# Altium project 解析板V1.0.PrjPcb
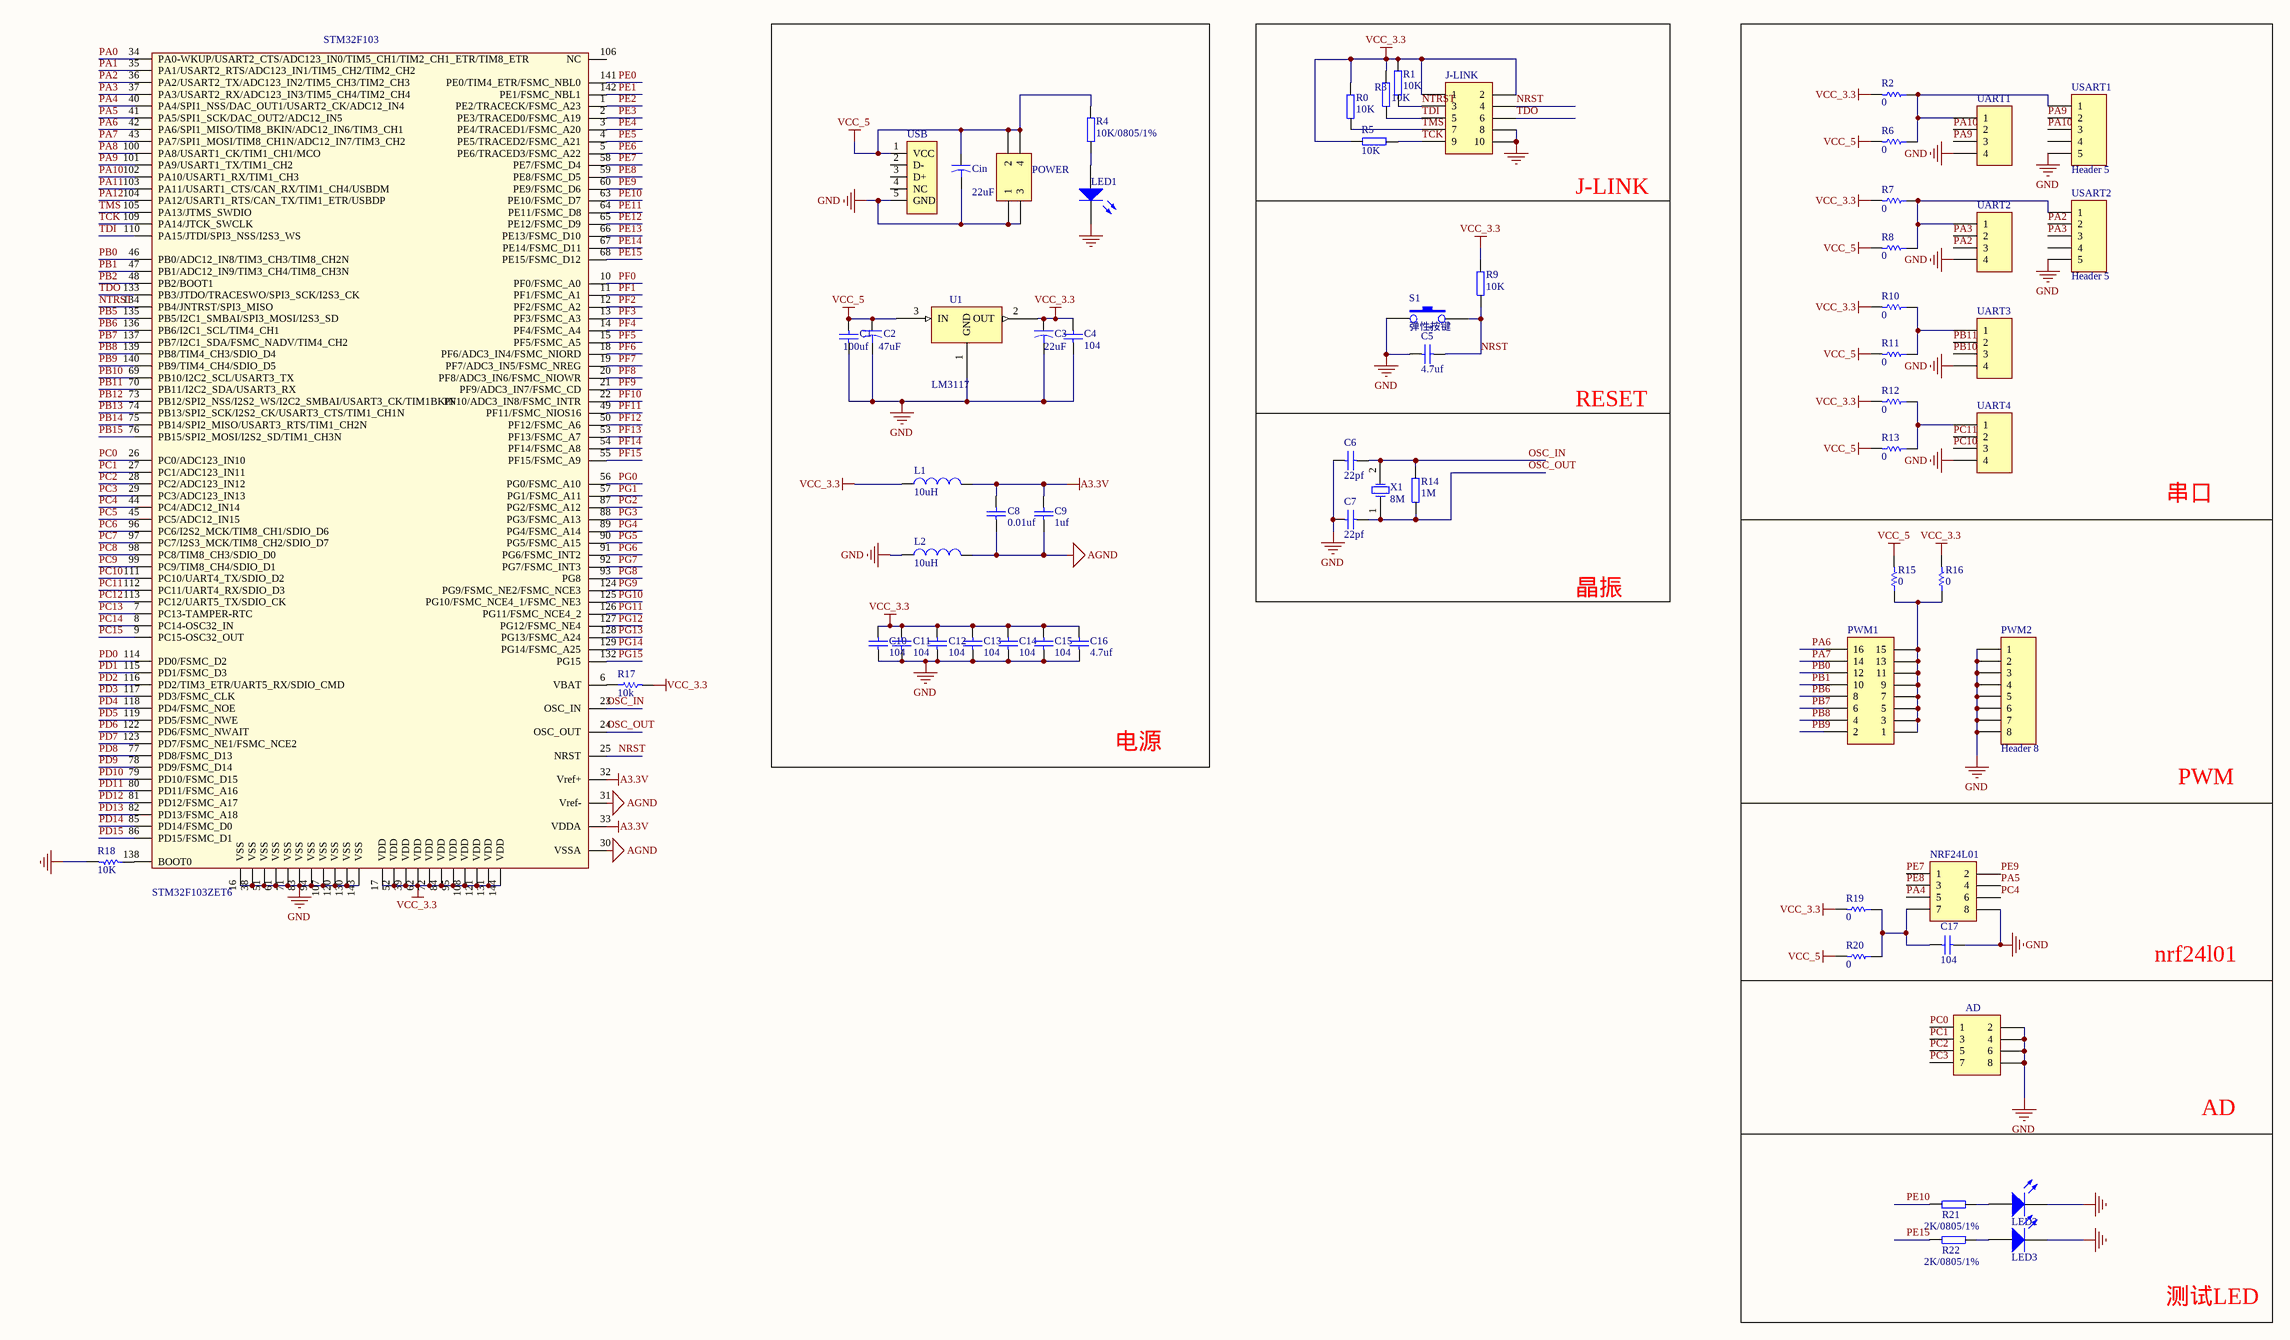
[diagram p0: 解析板V1.0.SchDoc]
1 sheet, 63 parts. Net scope: global (net labels, ports and power ports of the same name join across sheets).
Board file: 解析板V1.0.PcbDoc

## Sheet 解析板V1.0.SchDoc
size A2

### Parts
AD  Header 4X2  [HDR2X4]  (value not drawn)
C1  value 100uf  [0805]  (hidden comment: 0805)
C2  value 47uF  [1812]  (hidden comment: Cap2)
C3  value 22uF  [1812]  (hidden comment: Cap2)
C4  value 104  [0805]  (hidden comment: 0805)
C5  value 4.7uf  [0805]  (hidden comment: 0805)
C6  value 22pf  [0805]  (hidden comment: 0805)
C7  value 22pf  [0805]  (hidden comment: 0805)
C8  value 0.01uf  [0805]  (hidden comment: 0805)
C9  value 1uf  [0805]  (hidden comment: 0805)
C10  value 104  [0805]  (hidden comment: 0805)
C11  value 104  [0805]  (hidden comment: 0805)
C12  value 104  [0805]  (hidden comment: 0805)
C13  value 104  [0805]  (hidden comment: 0805)
C14  value 104  [0805]  (hidden comment: 0805)
C15  value 104  [0805]  (hidden comment: 0805)
C16  value 4.7uf  [0805]  (hidden comment: 0805)
C17  value 104  [0805]  (hidden comment: 0805)
Cin  value 22uF  [1812]  (hidden comment: Cap2)
J-LINK  Header 5X2  [HDR2X5]  (value not drawn)
L1  value 10uH  [0805]  (hidden comment: Inductor)
L2  value 10uH  [0805]  (hidden comment: Inductor)
LED1  LED  [0805]  (value not drawn)
LED2  LED  [0805]  (value not drawn)
LED3  LED  [0805]  (value not drawn)
NRF24L01  Header 4X2  [HDR2X4]  (value not drawn)
POWER  Header 2X2  [HDR2X2]  (value not drawn)
PWM1  Header 8X2  [HDR2X8]  (value not drawn)
PWM2  Header 8  [HDR1X8]
R0  10K  [0805]
R1  10K  [0805]
R2  value 0  [0805]  (hidden comment: Res1)
R3  10K  [0805]
R4  10K/0805/1%  [0805]
R5  10K  [0805]
R6  value 0  [0805]  (hidden comment: Res1)
R7  value 0  [0805]  (hidden comment: Res1)
R8  value 0  [0805]  (hidden comment: Res1)
R9  10K  [0805]
R10  value 0  [0805]  (hidden comment: Res1)
R11  value 0  [0805]  (hidden comment: Res1)
R12  value 0  [0805]  (hidden comment: Res1)
R13  value 0  [0805]  (hidden comment: Res1)
R14  1M  [0805]
R15  value 0  [0805]  (hidden comment: Res1)
R16  value 0  [0805]  (hidden comment: Res1)
R17  value 10k  [0805]  (hidden comment: Res1)
R18  10K  [0805]
R19  value 0  [0805]  (hidden comment: Res1)
R20  value 0  [0805]  (hidden comment: Res1)
R21  2K/0805/1%  [0805]
R22  2K/0805/1%  [0805]
S1  *  Comm: 弹性按键  [按键开关（贴片）]
STM32F103  STM32F103ZET6  [LQFP144]
U1  LM3117  [LM1117]
UART1  Header 4  [HDR1X4]  (value not drawn)
UART2  Header 4  [HDR1X4]  (value not drawn)
UART3  Header 4  [HDR1X4]  (value not drawn)
UART4  Header 4  [HDR1X4]  (value not drawn)
USART1  Header 5  [HDR1X5]
USART2  Header 5  [HDR1X5]
USB  USB-B(Mini)  [USB/SM0.8-6H5]  (value not drawn)
X1  8M  [0.5-晶振]

### Blocks framed on the sheet
电源: C1-C4 C8-C16 Cin L1 L2 LED1 POWER R4 U1 USB

### Nets
A3.3V: C8.1 C9.1 L1.2 STM32F103.32(Vref+) STM32F103.33(VDDA)
AGND: C8.2 C9.2 L2.2 STM32F103.30(VSSA) STM32F103.31(Vref-)
GND: AD.2 AD.4 AD.6 AD.8 C1.1 C2.2 C3.2 C4.1 C5.2 C6.2 C7.2 C10.2 C11.2 C12.2 C13.2 C14.2 C15.2 C16.2 C17.2 Cin.2 J-LINK.8 J-LINK.10 L2.1 LED1.2(K) LED2.2(K) LED3.2(K) NRF24L01.8 POWER.1 POWER.3 PWM2.1 PWM2.2 PWM2.3 PWM2.4 PWM2.5 PWM2.6 PWM2.7 PWM2.8 R18.2 S1.1 STM32F103.16(VSS) STM32F103.38(VSS) STM32F103.51(VSS) STM32F103.61(VSS) STM32F103.71(VSS) STM32F103.83(VSS) STM32F103.94(VSS) STM32F103.107(VSS) STM32F103.120(VSS) STM32F103.130(VSS) STM32F103.143(VSS) U1.1(GND) UART1.4 UART2.4 UART3.4 UART4.4 USART1.5 USART2.5 USB.5(GND)
VCC_3.3: C3.1 C4.2 C10.1 C11.1 C12.1 C13.1 C14.1 C15.1 C16.1 J-LINK.1 J-LINK.2 L1.1 R0.2 R1.2 R2.2 R3.2 R5.2 R7.2 R9.2 R10.2 R12.2 R16.2 R17.2 R19.2 STM32F103.17(VDD) STM32F103.39(VDD) STM32F103.52(VDD) STM32F103.62(VDD) STM32F103.72(VDD) STM32F103.84(VDD) STM32F103.95(VDD) STM32F103.108(VDD) STM32F103.121(VDD) STM32F103.131(VDD) STM32F103.144(VDD) U1.2(OUT)
VCC_5: C1.2 C2.1 Cin.1 POWER.2 POWER.4 R4.1 R6.2 R8.2 R11.2 R13.2 R15.2 R20.2 U1.3(IN) USB.1(VCC)
NRST: C5.1 J-LINK.4 R9.1 S1.2 STM32F103.25(NRST)
NTRST: J-LINK.3 R1.1 STM32F103.134(PB4/JNTRST/SPI3_MISO)
OSC_IN: C6.1 R14.2 STM32F103.23(OSC_IN) X1.2(OSC2)
OSC_OUT: C7.1 R14.1 STM32F103.24(OSC_OUT) X1.1(OSC1)
PA0: STM32F103.34(PA0-WKUP/USART2_CTS/ADC123_IN0/TIM5_CH1/TIM2_CH1_ETR/TIM8_ETR)
PA1: STM32F103.35(PA1/USART2_RTS/ADC123_IN1/TIM5_CH2/TIM2_CH2)
PA2: STM32F103.36(PA2/USART2_TX/ADC123_IN2/TIM5_CH3/TIM2_CH3) UART2.3 USART2.2
PA3: STM32F103.37(PA3/USART2_RX/ADC123_IN3/TIM5_CH4/TIM2_CH4) UART2.2 USART2.3
PA4: NRF24L01.5 STM32F103.40(PA4/SPI1_NSS/DAC_OUT1/USART2_CK/ADC12_IN4)
PA5: NRF24L01.4 STM32F103.41(PA5/SPI1_SCK/DAC_OUT2/ADC12_IN5)
PA6: PWM1.16 STM32F103.42(PA6/SPI1_MISO/TIM8_BKIN/ADC12_IN6/TIM3_CH1)
PA7: PWM1.14 STM32F103.43(PA7/SPI1_MOSI/TIM8_CH1N/ADC12_IN7/TIM3_CH2)
PA8: STM32F103.100(PA8/USART1_CK/TIM1_CH1/MCO)
PA9: STM32F103.101(PA9/USART1_TX/TIM1_CH2) UART1.3 USART1.2
PA10: STM32F103.102(PA10/USART1_RX/TIM1_CH3) UART1.2 USART1.3
PA11: STM32F103.103(PA11/USART1_CTS/CAN_RX/TIM1_CH4/USBDM)
PA12: STM32F103.104(PA12/USART1_RTS/CAN_TX/TIM1_ETR/USBDP)
PB0: PWM1.12 STM32F103.46(PB0/ADC12_IN8/TIM3_CH3/TIM8_CH2N)
PB1: PWM1.10 STM32F103.47(PB1/ADC12_IN9/TIM3_CH4/TIM8_CH3N)
PB2: STM32F103.48(PB2/BOOT1)
PB5: STM32F103.135(PB5/I2C1_SMBAI/SPI3_MOSI/I2S3_SD)
PB6: PWM1.8 STM32F103.136(PB6/I2C1_SCL/TIM4_CH1)
PB7: PWM1.6 STM32F103.137(PB7/I2C1_SDA/FSMC_NADV/TIM4_CH2)
PB8: PWM1.4 STM32F103.139(PB8/TIM4_CH3/SDIO_D4)
PB9: PWM1.2 STM32F103.140(PB9/TIM4_CH4/SDIO_D5)
PB10: STM32F103.69(PB10/I2C2_SCL/USART3_TX) UART3.3
PB11: STM32F103.70(PB11/I2C2_SDA/USART3_RX) UART3.2
PB12: STM32F103.73(PB12/SPI2_NSS/I2S2_WS/I2C2_SMBAI/USART3_CK/TIM1BKIN)
PB13: STM32F103.74(PB13/SPI2_SCK/I2S2_CK/USART3_CTS/TIM1_CH1N)
PB14: STM32F103.75(PB14/SPI2_MISO/USART3_RTS/TIM1_CH2N)
PB15: STM32F103.76(PB15/SPI2_MOSI/I2S2_SD/TIM1_CH3N)
PC0: AD.1 STM32F103.26(PC0/ADC123_IN10)
PC1: AD.3 STM32F103.27(PC1/ADC123_IN11)
PC2: AD.5 STM32F103.28(PC2/ADC123_IN12)
PC3: AD.7 STM32F103.29(PC3/ADC123_IN13)
PC4: NRF24L01.6 STM32F103.44(PC4/ADC12_IN14)
PC5: STM32F103.45(PC5/ADC12_IN15)
PC6: STM32F103.96(PC6/I2S2_MCK/TIM8_CH1/SDIO_D6)
PC7: STM32F103.97(PC7/I2S3_MCK/TIM8_CH2/SDIO_D7)
PC8: STM32F103.98(PC8/TIM8_CH3/SDIO_D0)
PC9: STM32F103.99(PC9/TIM8_CH4/SDIO_D1)
PC10: STM32F103.111(PC10/UART4_TX/SDIO_D2) UART4.3
PC11: STM32F103.112(PC11/UART4_RX/SDIO_D3) UART4.2
PC12: STM32F103.113(PC12/UART5_TX/SDIO_CK)
PC13: STM32F103.7(PC13-TAMPER-RTC)
PC14: STM32F103.8(PC14-OSC32_IN)
PC15: STM32F103.9(PC15-OSC32_OUT)
PD0: STM32F103.114(PD0/FSMC_D2)
PD1: STM32F103.115(PD1/FSMC_D3)
PD2: STM32F103.116(PD2/TIM3_ETR/UART5_RX/SDIO_CMD)
PD3: STM32F103.117(PD3/FSMC_CLK)
PD4: STM32F103.118(PD4/FSMC_NOE)
PD5: STM32F103.119(PD5/FSMC_NWE)
PD6: STM32F103.122(PD6/FSMC_NWAIT)
PD7: STM32F103.123(PD7/FSMC_NE1/FSMC_NCE2)
PD8: STM32F103.77(PD8/FSMC_D13)
PD9: STM32F103.78(PD9/FSMC_D14)
PD10: STM32F103.79(PD10/FSMC_D15)
PD11: STM32F103.80(PD11/FSMC_A16)
PD12: STM32F103.81(PD12/FSMC_A17)
PD13: STM32F103.82(PD13/FSMC_A18)
PD14: STM32F103.85(PD14/FSMC_D0)
PD15: STM32F103.86(PD15/FSMC_D1)
PE0: STM32F103.141(PE0/TIM4_ETR/FSMC_NBL0)
PE1: STM32F103.142(PE1/FSMC_NBL1)
PE2: STM32F103.1(PE2/TRACECK/FSMC_A23)
PE3: STM32F103.2(PE3/TRACED0/FSMC_A19)
PE4: STM32F103.3(PE4/TRACED1/FSMC_A20)
PE5: STM32F103.4(PE5/TRACED2/FSMC_A21)
PE6: STM32F103.5(PE6/TRACED3/FSMC_A22)
PE7: NRF24L01.1 STM32F103.58(PE7/FSMC_D4)
PE8: NRF24L01.3 STM32F103.59(PE8/FSMC_D5)
PE9: NRF24L01.2 STM32F103.60(PE9/FSMC_D6)
PE10: R21.1 STM32F103.63(PE10/FSMC_D7)
PE11: STM32F103.64(PE11/FSMC_D8)
PE12: STM32F103.65(PE12/FSMC_D9)
PE13: STM32F103.66(PE13/FSMC_D10)
PE14: STM32F103.67(PE14/FSMC_D11)
PE15: R22.1 STM32F103.68(PE15/FSMC_D12)
PF0: STM32F103.10(PF0/FSMC_A0)
PF1: STM32F103.11(PF1/FSMC_A1)
PF2: STM32F103.12(PF2/FSMC_A2)
PF3: STM32F103.13(PF3/FSMC_A3)
PF4: STM32F103.14(PF4/FSMC_A4)
PF5: STM32F103.15(PF5/FSMC_A5)
PF6: STM32F103.18(PF6/ADC3_IN4/FSMC_NIORD)
PF7: STM32F103.19(PF7/ADC3_IN5/FSMC_NREG)
PF8: STM32F103.20(PF8/ADC3_IN6/FSMC_NIOWR)
PF9: STM32F103.21(PF9/ADC3_IN7/FSMC_CD)
PF10: STM32F103.22(PF10/ADC3_IN8/FSMC_INTR)
PF11: STM32F103.49(PF11/FSMC_NIOS16)
PF12: STM32F103.50(PF12/FSMC_A6)
PF13: STM32F103.53(PF13/FSMC_A7)
PF14: STM32F103.54(PF14/FSMC_A8)
PF15: STM32F103.55(PF15/FSMC_A9)
PG0: STM32F103.56(PG0/FSMC_A10)
PG1: STM32F103.57(PG1/FSMC_A11)
PG2: STM32F103.87(PG2/FSMC_A12)
PG3: STM32F103.88(PG3/FSMC_A13)
PG4: STM32F103.89(PG4/FSMC_A14)
PG5: STM32F103.90(PG5/FSMC_A15)
PG6: STM32F103.91(PG6/FSMC_INT2)
PG7: STM32F103.92(PG7/FSMC_INT3)
PG8: STM32F103.93(PG8)
PG9: STM32F103.124(PG9/FSMC_NE2/FSMC_NCE3)
PG10: STM32F103.125(PG10/FSMC_NCE4_1/FSMC_NE3)
PG11: STM32F103.126(PG11/FSMC_NCE4_2)
PG12: STM32F103.127(PG12/FSMC_NE4)
PG13: STM32F103.128(PG13/FSMC_A24)
PG14: STM32F103.129(PG14/FSMC_A25)
PG15: STM32F103.132(PG15)
TCK: J-LINK.9 R5.1 STM32F103.109(PA14/JTCK_SWCLK)
TDI: J-LINK.5 R3.1 STM32F103.110(PA15/JTDI/SPI3_NSS/I2S3_WS)
TDO: J-LINK.6 STM32F103.133(PB3/JTDO/TRACESWO/SPI3_SCK/I2S3_CK)
TMS: J-LINK.7 R0.1 STM32F103.105(PA13/JTMS_SWDIO)
NetC17_1: C17.1 NRF24L01.7 R19.1 R20.1
NetLED1_1: LED1.1(A) R4.2
NetLED2_1: LED2.1(A) R21.2
NetLED3_1: LED3.1(A) R22.2
NetPWM1_1: PWM1.1 PWM1.3 PWM1.5 PWM1.7 PWM1.9 PWM1.11 PWM1.13 PWM1.15 R15.1 R16.1
NetR2_1: R2.1 R6.1 UART1.1 USART1.1
NetR7_1: R7.1 R8.1 UART2.1 USART2.1
NetR10_1: R10.1 R11.1 UART3.1
NetR12_1: R12.1 R13.1 UART4.1
NetR17_1: R17.1 STM32F103.6(VBAT)
NetR18_1: R18.1 STM32F103.138(BOOT0)

Not connected (* = marked no-connect by the designer): STM32F103 106(NC); USART1 4; USART2 4; USB 2(D-) 3(D+) 4(NC)

### Notes on the sheet
- J-LINK
- RESET
- 串口
- 晶振
- PWM
- nrf24l01
- AD
- 测试LED

### Library data of the parts
AD NRF24L01 = Header 4X2: Header, 4-Pin, Dual row; LatestRevisionDate: 17-Jul-2002; LatestRevisionNote: Re-released for DXP Platform.; Publisher: Altium Limited
C1 C4-C17 = Cap C0805: C0805
C2 C3 Cin = Cap2: Capacitor; Published: 23-Sep-2002; PackageReference: CAPR5-4X5; Publisher: Altium Limited
J-LINK = Header 5X2: Header, 5-Pin, Dual row; LatestRevisionDate: 17-Jul-2002; LatestRevisionNote: Re-released for DXP Platform.; Publisher: Altium Limited
L1 L2 = Inductor: Code_IEC: 1005; Published: 8-Jun-2000; LatestRevisionDate: 29-May-2009; LatestRevisionNote: IPC-7351 Footprint Added.; PackageReference: 0402-A; Publisher: Altium Limited; PackageDescription: Chip Inductor; Code_JEITA: 0402
POWER = Header 2X2: Header, 2-Pin, Dual row; LatestRevisionDate: 17-Jul-2002; LatestRevisionNote: Re-released for DXP Platform.; Publisher: Altium Limited
PWM1 = Header 8X2: Header, 8-Pin, Dual row; LatestRevisionDate: 17-Jul-2002; LatestRevisionNote: Re-released for DXP Platform.; Publisher: Altium Limited
PWM2 = Header 8: Header, 8-Pin; LatestRevisionDate: 17-Jul-2002; LatestRevisionNote: Re-released for DXP Platform.; Publisher: Altium Limited
R0 R1 R3-R5 R9 R14 R21 R22 = RES5
R2 R6-R8 R10-R13 R15-R17 R19 R20 = Res1: Resistor; Published: 8-Jun-2000; LatestRevisionDate: 17-Jul-2002; LatestRevisionNote: Re-released for DXP Platform.; PackageReference: AXIAL-0.3; Publisher: Altium Limited
R18 = res1: Resistor; Value: 1K; Published: 8-Jun-2000; Revision: July-2002: Re-released for DXP Platform.; Publisher: Altium Limited
S1 = 单弹性按键
U1 = LM1117
UART1-UART4 = Header 4: Header, 4-Pin; LatestRevisionDate: 17-Jul-2002; LatestRevisionNote: Re-released for DXP Platform.; Publisher: Altium Limited
USART1 USART2 = Header 5: Header, 5-Pin; LatestRevisionDate: 17-Jul-2002; LatestRevisionNote: Re-released for DXP Platform.; Publisher: Altium Limited
USB = USB5
X1 = XTAL